# EAGLE design ElectromagnetLevitationTest (EAGLE 9.0.1)
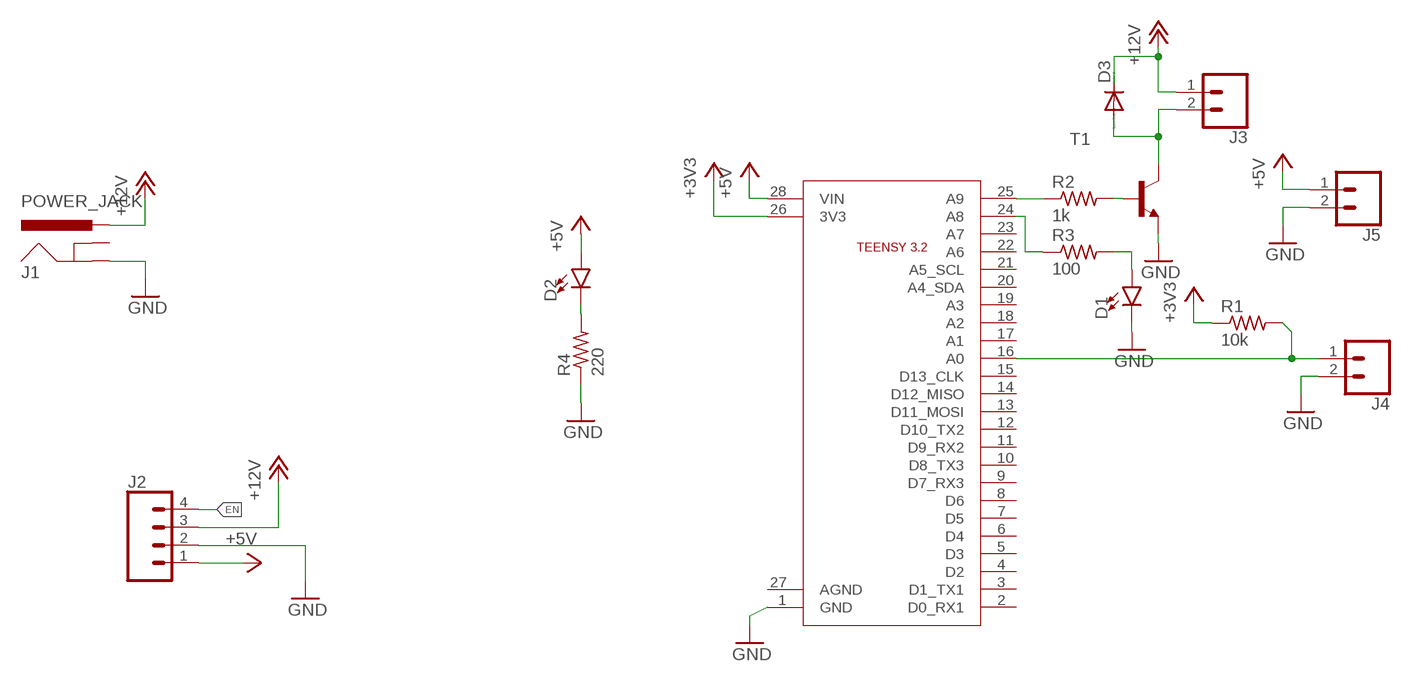
[diagram p0: schematic, sheet 1]

## Parts
D1  LED5MM  [LED_5MM]
D2  LED5MM  [LED_5MM]
D3  DIODE-D-7.5  [D-7.5]
J1  POWER_JACK  [POWER_JACK_PTH]
J2  CONN_04  [1X04]
J3  CONN_023.5MM  [SCREWTERMINAL-3.5MM-2]
J4  CONN_023.5MM  [SCREWTERMINAL-3.5MM-2]
J5  CONN_023.5MM  [SCREWTERMINAL-3.5MM-2]
R1  10k  R-US_0204/7  [0204/7]
R2  1k  R-US_0204/7  [0204/7]
R3  100  R-US_0204/7  [0204/7]
R4  220  R-US_0204/7  [0204/7]
T1  -NPN-TO220V  [TO220V]
U$1  TEENSY3.2  [TEENSY]

## Nets
+3V3: R1.1 U$1.26(3V3)
+5V: D2.A J2.1 J5.1 U$1.28(VIN)
+12V: D3.C J1.PWR J2.3 J3.1
EN: J2.4
GND: D1.K(C) J1.GND J2.2 J4.2 J5.2 R4.1 T1.3(E) U$1.1(GND)
N$1: J4.1 R1.2 U$1.16(A0)
N$2: R2.1 U$1.25(A9)
N$3: R2.2 T1.1(B)
N$4: D3.A J3.2 T1.2(C)
N$5: R3.1 U$1.24(A8)
N$7: D1.A R3.2
N$8: D2.K(C) R4.2
Unconnected: J1.GNDBREAK U$1.2(D0_RX1) U$1.3(D1_TX1) U$1.4(D2) U$1.5(D3) U$1.6(D4) U$1.7(D5) U$1.8(D6) U$1.9(D7_RX3) U$1.10(D8_TX3) U$1.11(D9_RX2) U$1.12(D10_TX2) U$1.13(D11_MOSI) U$1.14(D12_MISO) U$1.15(D13_CLK) U$1.17(A1) U$1.18(A2) U$1.19(A3) U$1.20(A4_SDA) U$1.21(A5_SCL) U$1.22(A6) U$1.23(A7) U$1.27(AGND)

## Library data of the parts
D1 D2 = SparkFun-LED:LED: LED (Generic) Standard schematic elements and footprints for 5mm, 3mm, 1206, and 0603 sized LEDs. Generic LEDs with no color specified.
D3 = diode:DIODE-: DIODE
J1 = SparkFun-Connectors:POWER_JACK: Power Jack Connector This is the standard 5.5mm barrel jack for power. The PTH is the most common, proven, reliable, footprint. The Slot footprint only works if the mill layer is transmitted to the PCB fab house so be warned. Here are the connectors we sell at SparkFun: DC Barrel Power Jack/Connector <https://www.sparkfun.com/products/119> (PRT-00119) DC Barrel Power Jack/Connector (SMD) <https://www.sparkfun.com/products/12748> (PRT-12748) DC Barrel Jack Adapter - Breadboard Compatible <https://www.sparkfun.com/products/10811> (PRT-10811) It is used on this SparkFun product (and many, many others): SparkFun RedBoard - Programmed with Arduino <https://www.sparkfun.com/products/12757> (DEV-12757) Also, if you need a mating power supply or connector, please check these out: Wall Adapter Power Supply - 9VDC 650mA <https://www.sparkfun.com/products/298> (TOL-00298) DC Barrel Jack Adapter - Male <https://www.sparkfun.com/products/10287> (PRT-10287); PROD_ID: CONN-08197
J2 = SparkFun-Connectors:CONN_04: Multi connection point. Often used as Generic Header-pin footprint for 0.1 inch spaced/style header connections On any of the 0.1 inch spaced packages, you can populate with these: Break Away Headers - Straight <https://www.sparkfun.com/products/116> (PRT-00116) Break Away Male Headers - Right Angle <https://www.sparkfun.com/products/553> (PRT-00553) Female Headers <https://www.sparkfun.com/products/115> (PRT-00115) Break Away Headers - Machine Pin <https://www.sparkfun.com/products/117> (PRT-00117) Break Away Female Headers - Swiss Machine Pin <https://www.sparkfun.com/products/743> (PRT-00743) For SCREWTERMINALS and SPRING TERMINALS visit here: Screw Terimnals on SparkFun.com <https://www.sparkfun.com/search/results?term=Screw+Terminals> (5mm/3.5mm/2.54mm spacing) This device is also useful as a general connection point to wire up your design to another part of your project. Our various solder wires solder well into these plated through hole pads. Hook-Up Wire - Assortment (Stranded, 22 AWG) <https://www.sparkfun.com/products/11375> (PRT-11375) Hook-Up Wire - Assortment (Solid Core, 22 AWG) <https://www.sparkfun.com/products/11367> (PRT-11367) View the entire wire category on our website here <https://www.sparkfun.com/categories/141> Special notes: Molex polarized connector foot print use with SKU : PRT-08231 with associated crimp pins and housings. 1MM SMD Version SKU: PRT-10208; PROD_ID: CONN-09696
J3-J5 = SparkFun-Connectors:CONN_02: Multi connection point. Often used as Generic Header-pin footprint for 0.1 inch spaced/style header connections On any of the 0.1 inch spaced packages, you can populate with these: Break Away Headers - Straight <https://www.sparkfun.com/products/116> (PRT-00116) Break Away Male Headers - Right Angle <https://www.sparkfun.com/products/553> (PRT-00553) Female Headers <https://www.sparkfun.com/products/115> (PRT-00115) Break Away Headers - Machine Pin <https://www.sparkfun.com/products/117> (PRT-00117) Break Away Female Headers - Swiss Machine Pin <https://www.sparkfun.com/products/743> (PRT-00743) For SCREWTERMINALS and SPRING TERMINALS visit here: Screw Terimnals on SparkFun.com <https://www.sparkfun.com/search/results?term=Screw+Terminals> (5mm/3.5mm/2.54mm spacing) This device is also useful as a general connection point to wire up your design to another part of your project. Our various solder wires solder well into these plated through hole pads. Hook-Up Wire - Assortment (Stranded, 22 AWG) <https://www.sparkfun.com/products/11375> (PRT-11375) Hook-Up Wire - Assortment (Solid Core, 22 AWG) <https://www.sparkfun.com/products/11367> (PRT-11367) View the entire wire category on our website here <https://www.sparkfun.com/categories/141> Special notes: Molex polarized connector foot print use with: PRT-08233 with associated crimp pins and housings. 2.54_SCREWTERM for use with PRT-10571. 3.5mm Screw Terminal footprints for PRT-08084 5mm Screw Terminal footprints for use with PRT-08432; PROD_ID: CONN-08399
R1-R4 = rcl:R-US_: RESISTOR, American symbol; SPICEPREFIX: R
T1 = transistor:*-NPN-: NPN Transistror BF959 corrected 2008.03.06
U$1 = EzerLonginus:TEENSY

## Board
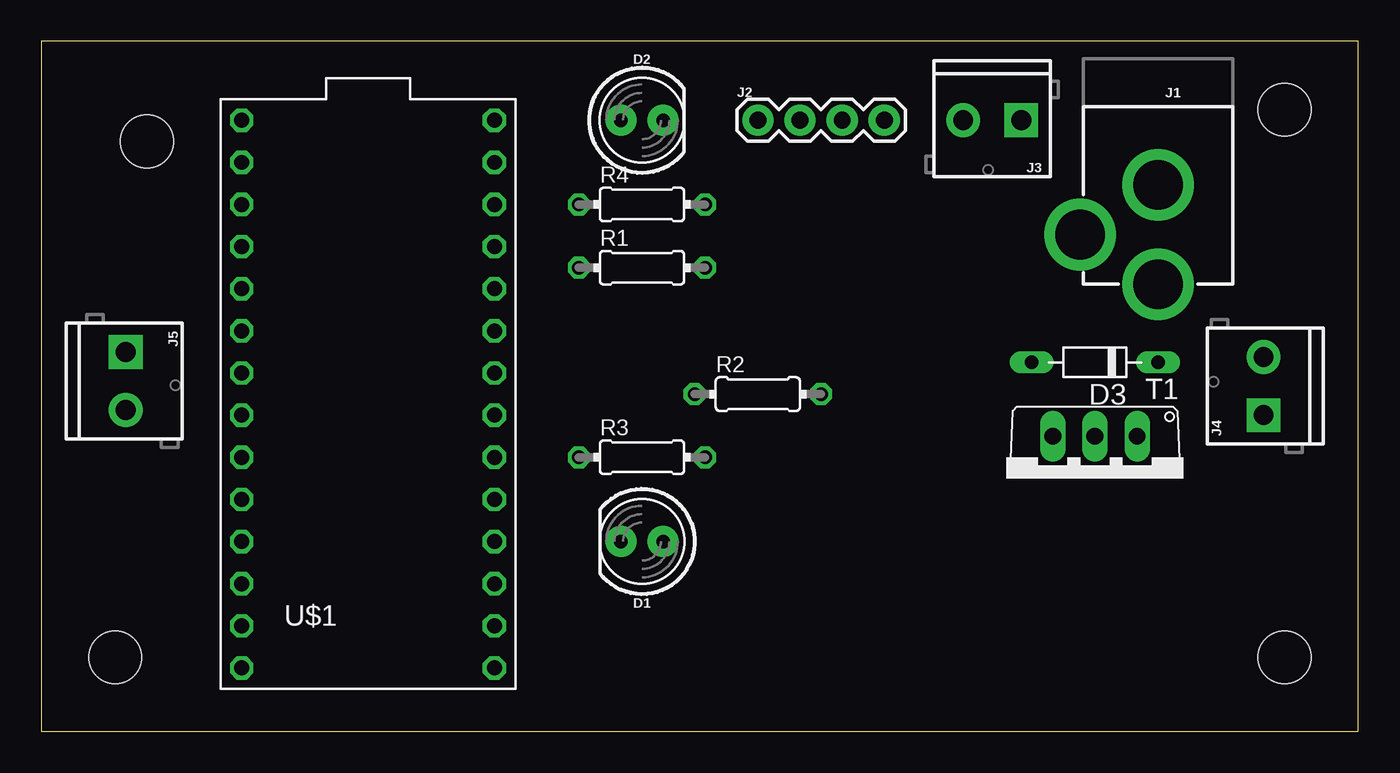
[diagram p1: board, top side]
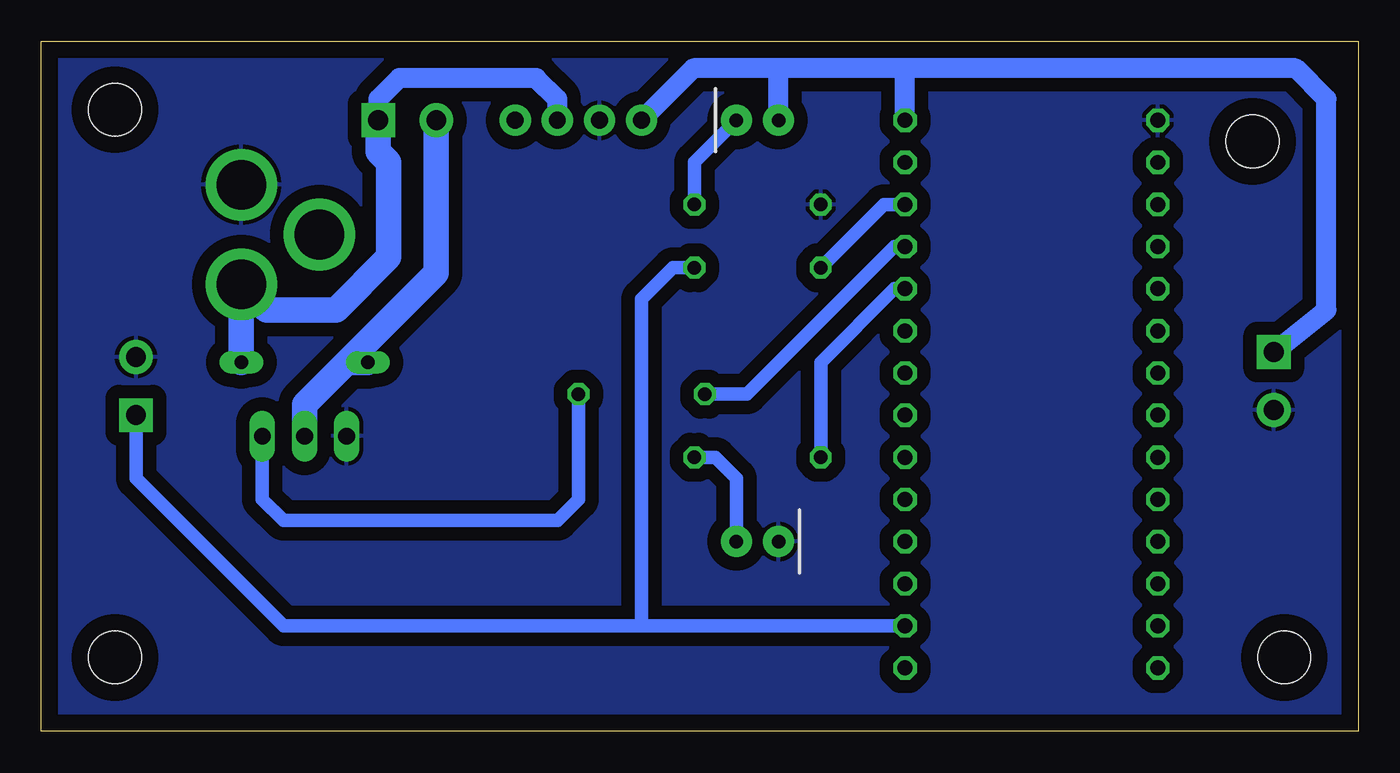
[diagram p2: board, bottom side, seen from below]

Size 79.36 x 41.58 mm. Coordinates in mm from the lower left corner, seen from the top.
Outline: 0,0 79.36,0 79.36,41.58 0,41.58 0,0
Copper layers (1*16): Top 0.035mm / dielectric 1.5mm / Bottom 0.035mm
Design rules "default": minimum track width 6mil, minimum drill 0.35mm, track to track 6mil, track to pad 6mil, pad to pad 6mil, via to via 6mil, smd to smd 6mil, copper to edge 40mil, drill to drill 6mil, minimum pad ring 10mil, minimum via ring 8mil, stop-mask expansion 4mil, vias tented up to drill 0mil, thermal gap 10mil
Holes 3.17 mm at 6.35,35.56 4.45,4.45 74.93,4.45 74.93,37.47

### Footprints (pad centres in the part's own frame; a part is rotated, then mirrored left to right if it is on the bottom)
LED_5MM = drill 0.813 pad 1.88: A -1.27,0; K 1.27,0
D-7.5 = drill 0.813 long: A 3.81,0; C -3.81,0
POWER_JACK_PTH = drill 2.997 pad 4.318: GND 0,7.7; GNDBREAK 4.7,10.7; PWR 0,13.7
1X04 = drill 1.016 pad 1.88: 1 0,0; 2 2.54,0; 3 5.08,0; 4 7.62,0
SCREWTERMINAL-3.5MM-2 = drill 1.2 pad 2.032 square: 1 0,0 | drill 1.2 pad 2.032: 2 3.5,0
0204/7 = drill 0.813 octagon: 1 -3.81,0; 2 3.81,0
TO220V = drill 1.016 long: 1 -2.54,-2.54; 2 0,-2.54; 3 2.54,-2.54
TEENSY = drill 0.9 octagon: 1 -7.62,17.78; 2 -7.62,15.24; 3 -7.62,12.7; 4 -7.62,10.16; 5 -7.62,7.62; 6 -7.62,5.08; 7 -7.62,2.54; 8 -7.62,0; 9 -7.62,-2.54; 10 -7.62,-5.08; 11 -7.62,-7.62; 12 -7.62,-10.16; 13 -7.62,-12.7; 14 -7.62,-15.24; 15 7.62,-15.24; 16 7.62,-12.7; 17 7.62,-10.16; 18 7.62,-7.62; 19 7.62,-5.08; 20 7.62,-2.54; 21 7.62,0; 22 7.62,2.54; 23 7.62,5.08; 24 7.62,7.62; 25 7.62,10.16; 26 7.62,12.7; 27 7.62,15.24; 28 7.62,17.78

### Placement (x,y rotation side)
D1  36.2,11.43 180 top
D2  36.2,36.83 0 top
D3  63.5,22.23 180 top
J1  67.31,40.64 180 top
J2  43.18,36.83 0 top
J3  59.05,36.83 180 top
J4  73.66,19.05 90 top
J5  5.08,22.86 270 top
R1  36.2,27.94 0 top
R2  43.18,20.32 0 top
R3  36.2,16.51 0 top
R4  36.2,31.75 0 top
T1  63.5,15.24 180 top
U$1  19.68,19.05 0 top

### Tracks (layer width: path | path; a pad name or v marks a point on that pad's centre or on a via)
+3V3
  Bottom 0.813: R1.1 28.57,31.75 U$1.26
+5V
  Bottom 1.219: J5.1 1.91,25.4 1.91,38.1 3.76,39.95 27.3,39.95 | J2.1 40.06,39.95 34.92,39.95 | 27.3,39.95 34.92,39.95 | U$1.28 27.3,39.95 | D2.A 34.92,39.95
+12V
  Bottom 1.219: J2.3 48.26,38.1 49.53,39.37 57.78,39.37 59.05,38.1 J3.1
  Bottom 1.524: J3.1 59.05,34.92 58.42,34.29 58.42,28.57 61.59,25.4 65.77,25.4 J1.PWR 66.67,26.3 67.31,25.67 67.31,24.77 D3.C
GND
  pour Bottom (isolate 0.813): 0,41.91 79.38,41.91 79.38,0 0,0
N$1
  Bottom 0.813: 43.18,6.35 43.18,26.04 41.27,27.94 R1.2 | U$1.16 43.18,6.35 | 43.18,6.35 64.77,6.35 73.66,15.24 J4.1
N$2
  Bottom 0.813: R2.1 36.83,20.32 27.94,29.21 U$1.25
N$3
  Bottom 0.813: T1.1 66.04,13.97 64.77,12.7 48.26,12.7 46.99,13.97 R2.2
N$4
  Bottom 1.524: J3.2 55.55,27.63 60.96,22.23 | 60.96,22.23 63.5,19.68 T1.2 | D3.A 60.96,22.23
N$5
  Bottom 0.813: R3.1 32.38,22.23 27.94,26.67 U$1.24
N$7
  Bottom 0.813: R3.2 38.73,16.51 37.47,15.24 D1.A
N$8
  Bottom 0.813: R4.2 40.01,34.29 D2.K